# EAGLE schematic power_regulator (EAGLE 9.1.0)
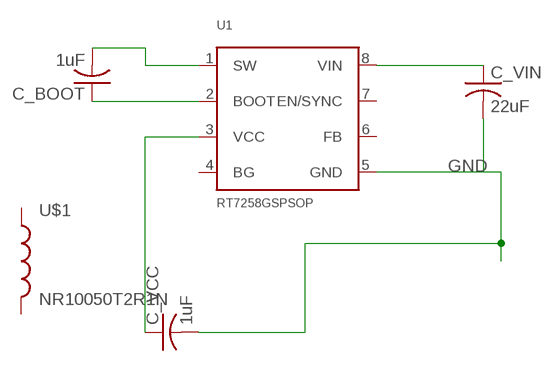
[diagram p0: schematic, sheet 1]

## Parts
C_BOOT  1uF  C-USC0603  [C0603]
C_VCC  1uF  C-USC0603  [C0603]
C_VIN  22uF  C-USC0603  [C0603]
U1  RT7258GSPSOP  [SOP08]
U$1  NR10050T2R1N  [NR10050T2R1N]

## Nets
GND: C_VCC.2 C_VIN.2 U1.5(GND)
N$1: C_VIN.1 U1.8(VIN)
N$2: C_VCC.1 U1.3(VCC)
N$3: C_BOOT.1 U1.2(BOOT)
N$4: C_BOOT.2 U1.1(SW)
Unconnected: U1.4(BG) U1.6(FB) U1.7(EN/SYNC) U$1.P$1 U$1.P$2

## Library data of the parts
C_BOOT C_VCC C_VIN = resistor:C-US: CAPACITOR, American symbol
U1 = gcp:RT7258GSP: The RT7258 is a synchronous step-down DC/DC converter with an integrated high side internal power MOSFET and a gate driver for a low side external power MOSFET. It can deliver up to 8A output current from a 4.5V to 24V input supply.
U$1 = gcp:NR10050T2R1N